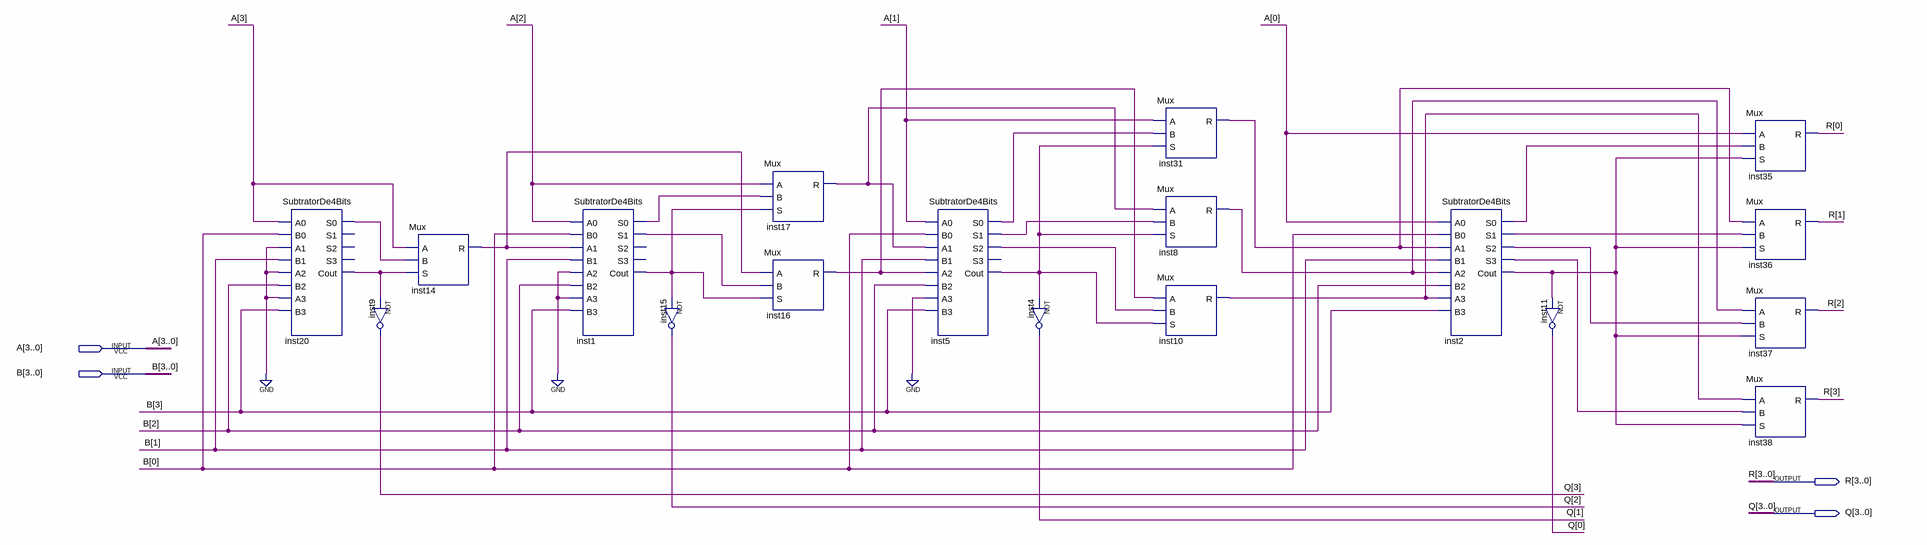
[diagram p0: schematic sheet]
// Quartus schematic Divisor4x4.bdf as structural Verilog: 18 symbols, 4 pins
module Divisor4x4 (
  input  [3:0] A,
  input  [3:0] B,
  output [3:0] R,
  output [3:0] Q
);

  wire inst1_cout, inst1_s0, inst1_s1, inst2_cout, inst2_s0, inst2_s1, inst2_s2, inst2_s3, inst5_cout,
       inst5_s0, inst5_s1, inst5_s2, inst8_r, inst10_r, inst14_r, inst16_r, inst17_r, inst20_cout, inst20_s0,
       inst31_r;

  SubtratorDe4Bits inst20 (
    .A0(A[3]), .B0(B[0]), .A1(1'b0), .B1(B[1]), .A2(1'b0), .B2(B[2]), .A3(1'b0), .B3(B[3]), .S0(inst20_s0),
    .Cout(inst20_cout));  // open: S1, S2, S3
  not inst9 (Q[3], inst20_cout);
  Mux inst14 (.A(A[3]), .B(inst20_s0), .S(inst20_cout), .R(inst14_r));
  SubtratorDe4Bits inst1 (
    .A0(A[2]), .B0(B[0]), .A1(inst14_r), .B1(B[1]), .A2(1'b0), .B2(B[2]), .A3(1'b0), .B3(B[3]),
    .S0(inst1_s0), .S1(inst1_s1), .Cout(inst1_cout));  // open: S2, S3
  not inst15 (Q[2], inst1_cout);
  Mux inst17 (.A(A[2]), .B(inst1_s0), .S(inst1_cout), .R(inst17_r));
  Mux inst16 (.A(inst14_r), .B(inst1_s1), .S(inst1_cout), .R(inst16_r));
  SubtratorDe4Bits inst5 (
    .A0(A[1]), .B0(B[0]), .A1(inst17_r), .B1(B[1]), .A2(inst16_r), .B2(B[2]), .A3(1'b0), .B3(B[3]),
    .S0(inst5_s0), .S1(inst5_s1), .S2(inst5_s2), .Cout(inst5_cout));  // open: S3
  not inst4 (Q[1], inst5_cout);
  Mux inst31 (.A(A[1]), .B(inst5_s0), .S(inst5_cout), .R(inst31_r));
  Mux inst8 (.A(inst17_r), .B(inst5_s1), .S(inst5_cout), .R(inst8_r));
  Mux inst10 (.A(inst16_r), .B(inst5_s2), .S(inst5_cout), .R(inst10_r));
  SubtratorDe4Bits inst2 (
    .A0(A[0]), .B0(B[0]), .A1(inst31_r), .B1(B[1]), .A2(inst8_r), .B2(B[2]), .A3(inst10_r), .B3(B[3]),
    .S0(inst2_s0), .S1(inst2_s1), .S2(inst2_s2), .S3(inst2_s3), .Cout(inst2_cout));
  not inst11 (Q[0], inst2_cout);
  Mux inst35 (.A(A[0]), .B(inst2_s0), .S(inst2_cout), .R(R[0]));
  Mux inst36 (.A(inst31_r), .B(inst2_s1), .S(inst2_cout), .R(R[1]));
  Mux inst37 (.A(inst8_r), .B(inst2_s2), .S(inst2_cout), .R(R[2]));
  Mux inst38 (.A(inst10_r), .B(inst2_s3), .S(inst2_cout), .R(R[3]));
endmodule
